# EAGLE design TesteTouchScreen (EAGLE 6.2)
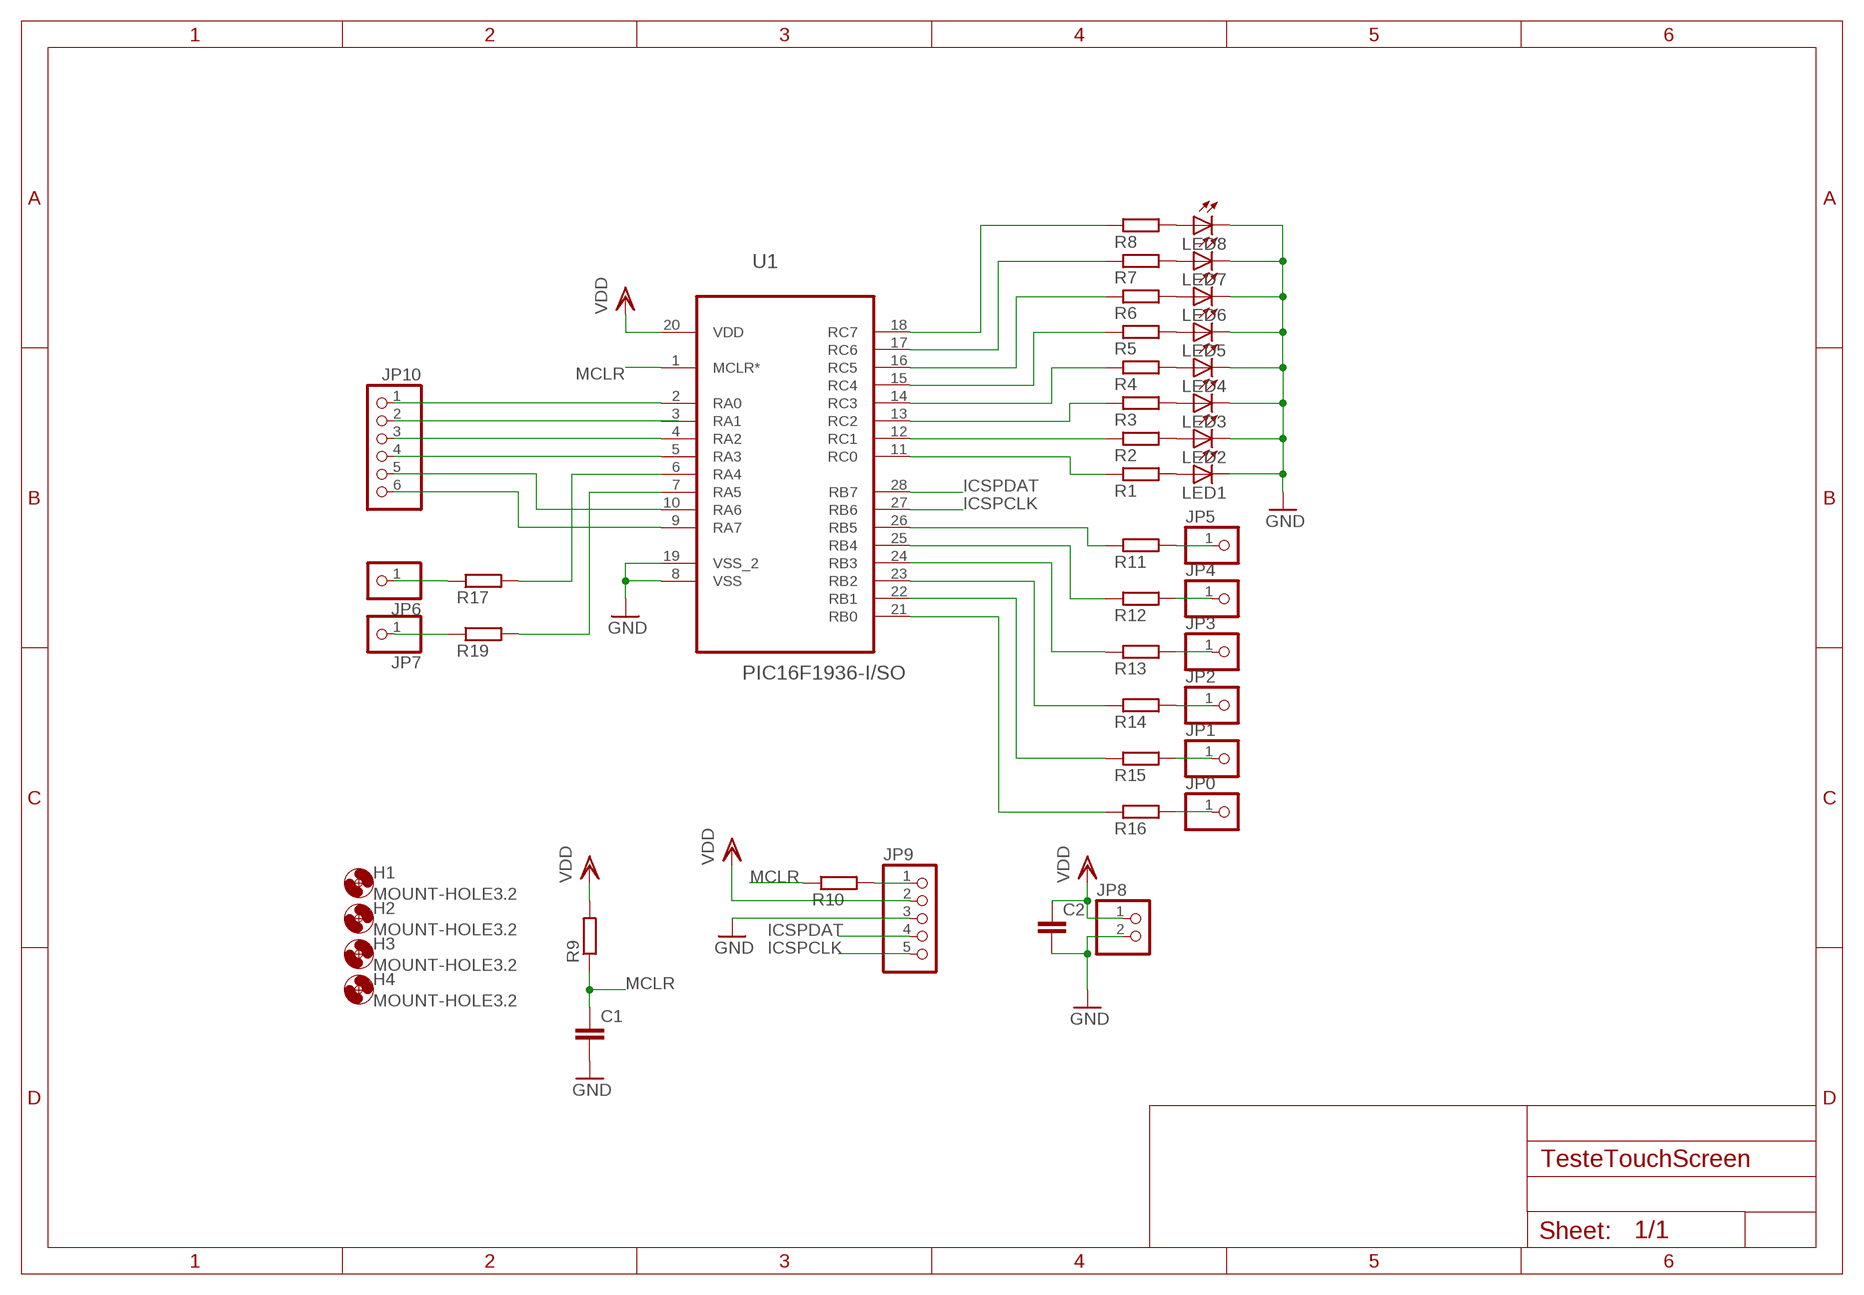
[diagram p0: schematic, sheet 1]

## Parts
C1  C-EUC1206  [C1206]
C2  C-EUC1206  [C1206]
H1  MOUNT-HOLE3.2  [3,2]
H2  MOUNT-HOLE3.2  [3,2]
H3  MOUNT-HOLE3.2  [3,2]
H4  MOUNT-HOLE3.2  [3,2]
JP0  PINHD-1X1  [1X01]
JP1  PINHD-1X1  [1X01]
JP2  PINHD-1X1  [1X01]
JP3  PINHD-1X1  [1X01]
JP4  PINHD-1X1  [1X01]
JP5  PINHD-1X1  [1X01]
JP6  PINHD-1X1  [1X01]
JP7  PINHD-1X1  [1X01]
JP8  PINHD-1X2  [1X02]
JP9  PINHD-1X5  [1X05]
JP10  PINHD-1X6  [1X06]
LED1  LED5MM  [LED5MM]
LED2  LED5MM  [LED5MM]
LED3  LED5MM  [LED5MM]
LED4  LED5MM  [LED5MM]
LED5  LED5MM  [LED5MM]
LED6  LED5MM  [LED5MM]
LED7  LED5MM  [LED5MM]
LED8  LED5MM  [LED5MM]
R1  R-EU_R0805  [R0805]
R2  R-EU_R0805  [R0805]
R3  R-EU_R0805  [R0805]
R4  R-EU_R0805  [R0805]
R5  R-EU_R0805  [R0805]
R6  R-EU_R0805  [R0805]
R7  R-EU_R0805  [R0805]
R8  R-EU_R0805  [R0805]
R9  R-EU_R0805  [R0805]
R10  R-EU_R0805  [R0805]
R11  R-EU_R0805  [R0805]
R12  R-EU_R0805  [R0805]
R13  R-EU_R0805  [R0805]
R14  R-EU_R0805  [R0805]
R15  R-EU_R0805  [R0805]
R16  R-EU_R0805  [R0805]
R17  R-EU_R0805  [R0805]
R19  R-EU_R0805  [R0805]
U1  PIC16F1936-I/SO  [SOIC127P1030X265-28N]

## Nets
GND: C1.2 C2.2 JP8.2 JP9.3 LED1.K(C) LED2.K(C) LED3.K(C) LED4.K(C) LED5.K(C) LED6.K(C) LED7.K(C) LED8.K(C) U1.8(VSS) U1.19(VSS_2)
ICSPCLK: JP9.5 U1.27(RB6)
ICSPDAT: JP9.4 U1.28(RB7)
MCLR: C1.1 R9.1 R10.1 U1.1(MCLR*)
N$1: JP6.1 R17.1
N$2: JP7.1 R19.1
N$3: JP0.1 R16.2
N$4: JP1.1 R15.2
N$5: JP2.1 R14.2
N$6: JP3.1 R13.2
N$7: JP5.1 R11.2
N$8: R17.2 U1.6(RA4)
N$9: LED1.A R1.2
N$10: LED2.A R2.2
N$11: JP4.1 R12.2
N$12: LED3.A R3.2
N$13: LED4.A R4.2
N$14: LED5.A R5.2
N$15: LED6.A R6.2
N$16: LED7.A R7.2
N$17: LED8.A R8.2
N$18: R1.1 U1.11(RC0)
N$19: R2.1 U1.12(RC1)
N$20: R3.1 U1.13(RC2)
N$21: R4.1 U1.14(RC3)
N$22: R5.1 U1.15(RC4)
N$23: R6.1 U1.16(RC5)
N$24: R7.1 U1.17(RC6)
N$25: R8.1 U1.18(RC7)
N$26: JP9.1 R10.2
N$27: R19.2 U1.7(RA5)
N$28: R11.1 U1.26(RB5)
N$29: R12.1 U1.25(RB4)
N$30: R13.1 U1.24(RB3)
N$31: R14.1 U1.23(RB2)
N$32: R15.1 U1.22(RB1)
N$33: R16.1 U1.21(RB0)
N$34: JP10.1 U1.2(RA0)
N$35: JP10.2
N$36: JP10.3 U1.4(RA2)
N$37: JP10.4 U1.5(RA3)
N$38: JP10.5 U1.10(RA6)
N$39: JP10.6 U1.9(RA7)
VDD: C2.1 JP8.1 JP9.2 R9.2 U1.20(VDD)
Unconnected: U1.3(RA1)

## Library data of the parts
C1 C2 = rcl:C-EU: CAPACITOR, European symbol
H1-H4 = holes:MOUNT-HOLE: MOUNTING HOLE with drill center marker
JP0 JP1-JP7 = pinhead:PINHD-1X1: PIN HEADER
JP8 = pinhead:PINHD-1X2: PIN HEADER
JP9 = pinhead:PINHD-1X5: PIN HEADER
JP10 = pinhead:PINHD-1X6: PIN HEADER
LED1-LED8 = led:LED: LED OSRAM: - CHIPLED LG R971, LG N971, LY N971, LG Q971, LY Q971, LO R971, LY R971 LH N974, LH R974 LS Q976, LO Q976, LY Q976 LO Q996 - Hyper CHIPLED LW Q18S LB Q993, LB Q99A, LB R99A - SideLED LS A670, LO A670, LY A670, LG A670, LP A670 LB A673, LV A673, LT A673, LW A673 LH A674 LY A675 LS A676, LA A676, LO A676, LY A676, LW A676 LS A679, LY A679, LG A679 - Hyper Micro SIDELED® LS Y876, LA Y876, LO Y876, LY Y876 LT Y87S - SmartLED LW L88C, LW L88S LB L89C, LB L89S, LG L890 LS L89K, LO L89K, LY L89K LS L896, LA L896, LO L896, LY L896 - TOPLED LS T670, LO T670, LY T670, LG T670, LP T670 LSG T670, LSP T670, LSY T670, LOP T670, LYG T670 LG T671, LOG T671, LSG T671 LB T673, LV T673, LT T673, LW T673 LH T674 LS T676, LA T676, LO T676, LY T676, LB T676, LH T676, LSB T676, LW T676 LB T67C, LV T67C, LT T67C, LS T67K, LO T67K, LY T67K, LW E67C LS E67B, LA E67B, LO E67B, LY E67B, LB E67C, LV E67C, LT E67C LW T67C LS T679, LY T679, LG T679 LS T770, LO T770, LY T770, LG T770, LP T770 LB T773, LV T773, LT T773, LW T773 LH T774 LS E675, LA E675, LY E675, LS T675 LS T776, LA T776, LO T776, LY T776, LB T776 LHGB T686 LT T68C, LB T68C - Hyper Mini TOPLED® LB M676 - Mini TOPLED Santana® LG M470 LS M47K, LO M47K, LY M47K Source: http://www.osram.convergy.de LUXEON: - LUMILED® LXK2-PW12-R00, LXK2-PW12-S00, LXK2-PW14-U00, LXK2-PW14-V00 LXK2-PM12-R00, LXK2-PM12-S00, LXK2-PM14-U00 LXK2-PE12-Q00, LXK2-PE12-R00, LXK2-PE12-S00, LXK2-PE14-T00, LXK2-PE14-U00 LXK2-PB12-K00, LXK2-PB12-L00, LXK2-PB12-M00, LXK2-PB14-N00, LXK2-PB14-P00, LXK2-PB14-Q00 LXK2-PR12-L00, LXK2-PR12-M00, LXK2-PR14-Q00, LXK2-PR14-R00 LXK2-PD12-Q00, LXK2-PD12-R00, LXK2-PD12-S00 LXK2-PH12-R00, LXK2-PH12-S00 LXK2-PL12-P00, LXK2-PL12-Q00, LXK2-PL12-R00 Source: www.luxeon.com KINGBRIGHT: KA-3528ASYC Source: www.kingbright.com
R1-R17 R19 = rcl:R-EU_: RESISTOR, European symbol
U1 = Microchip-PIC16F1936-I_SO:PIC16F1936-I/SO: IC PIC MCU FLASH 512KX14 ,SOIC-28; MPN: PIC16F1936-I/SO; OC_FARNELL: 1755820; OC_NEWARK: 45P4764; PACKAGE: SOIC-28; SUPPLIER: Microchip

## Board
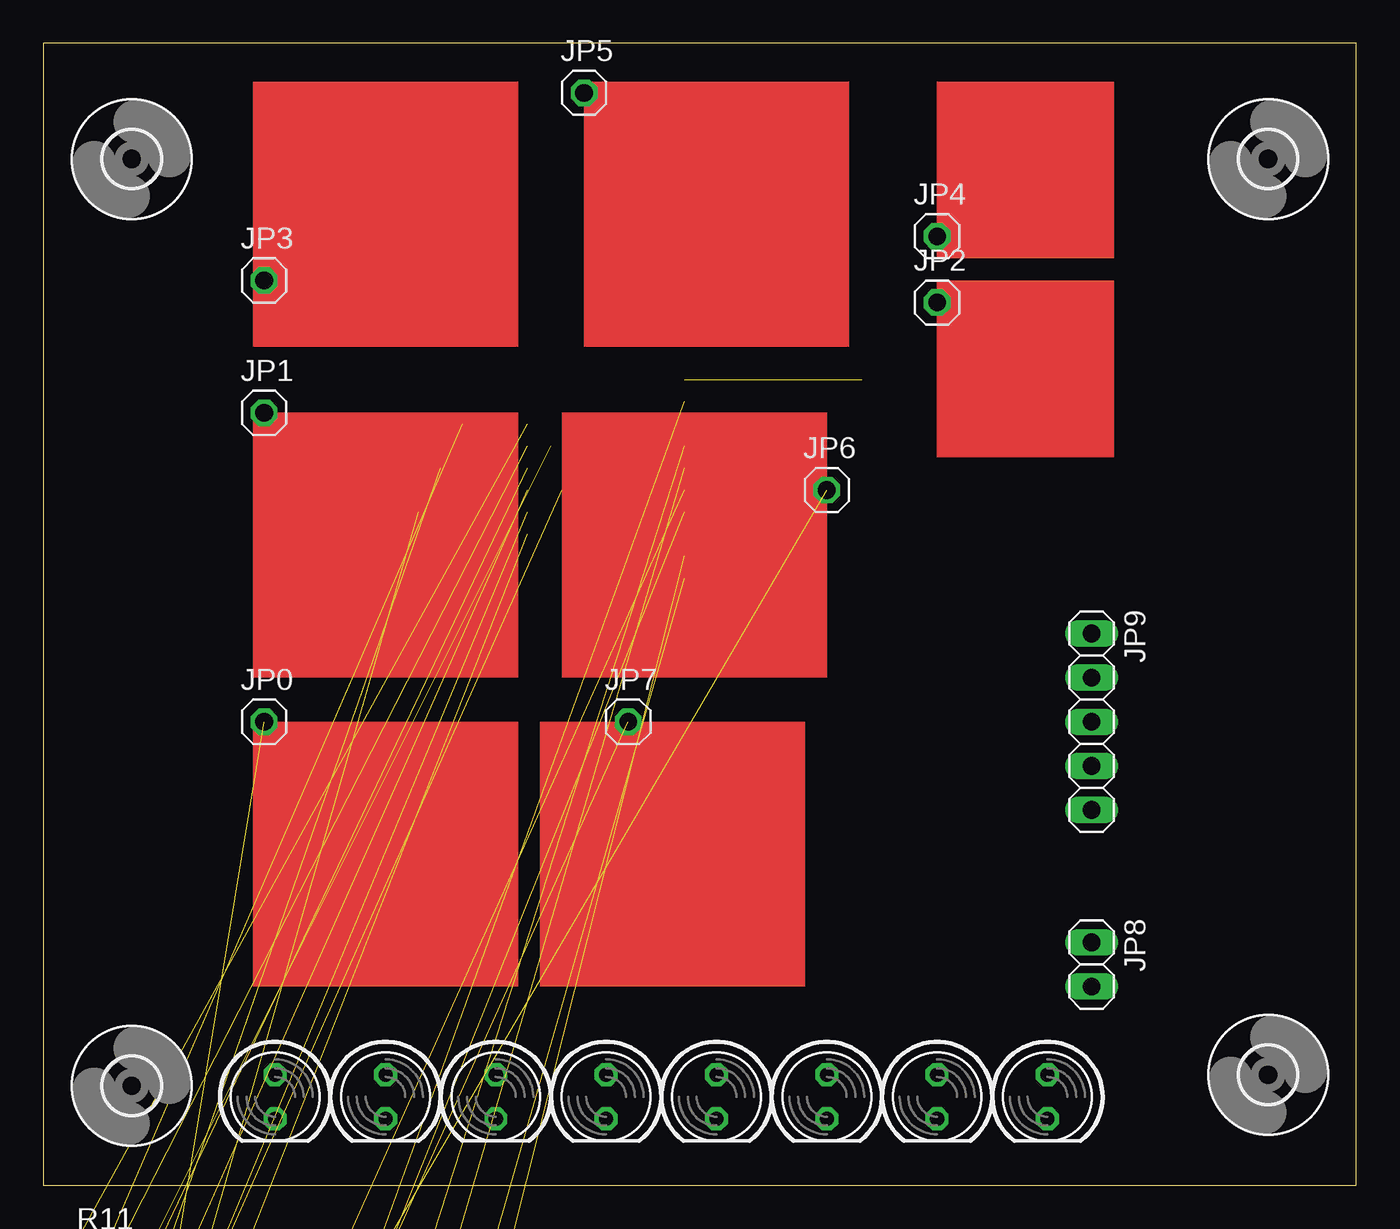
[diagram p1: board, top side]
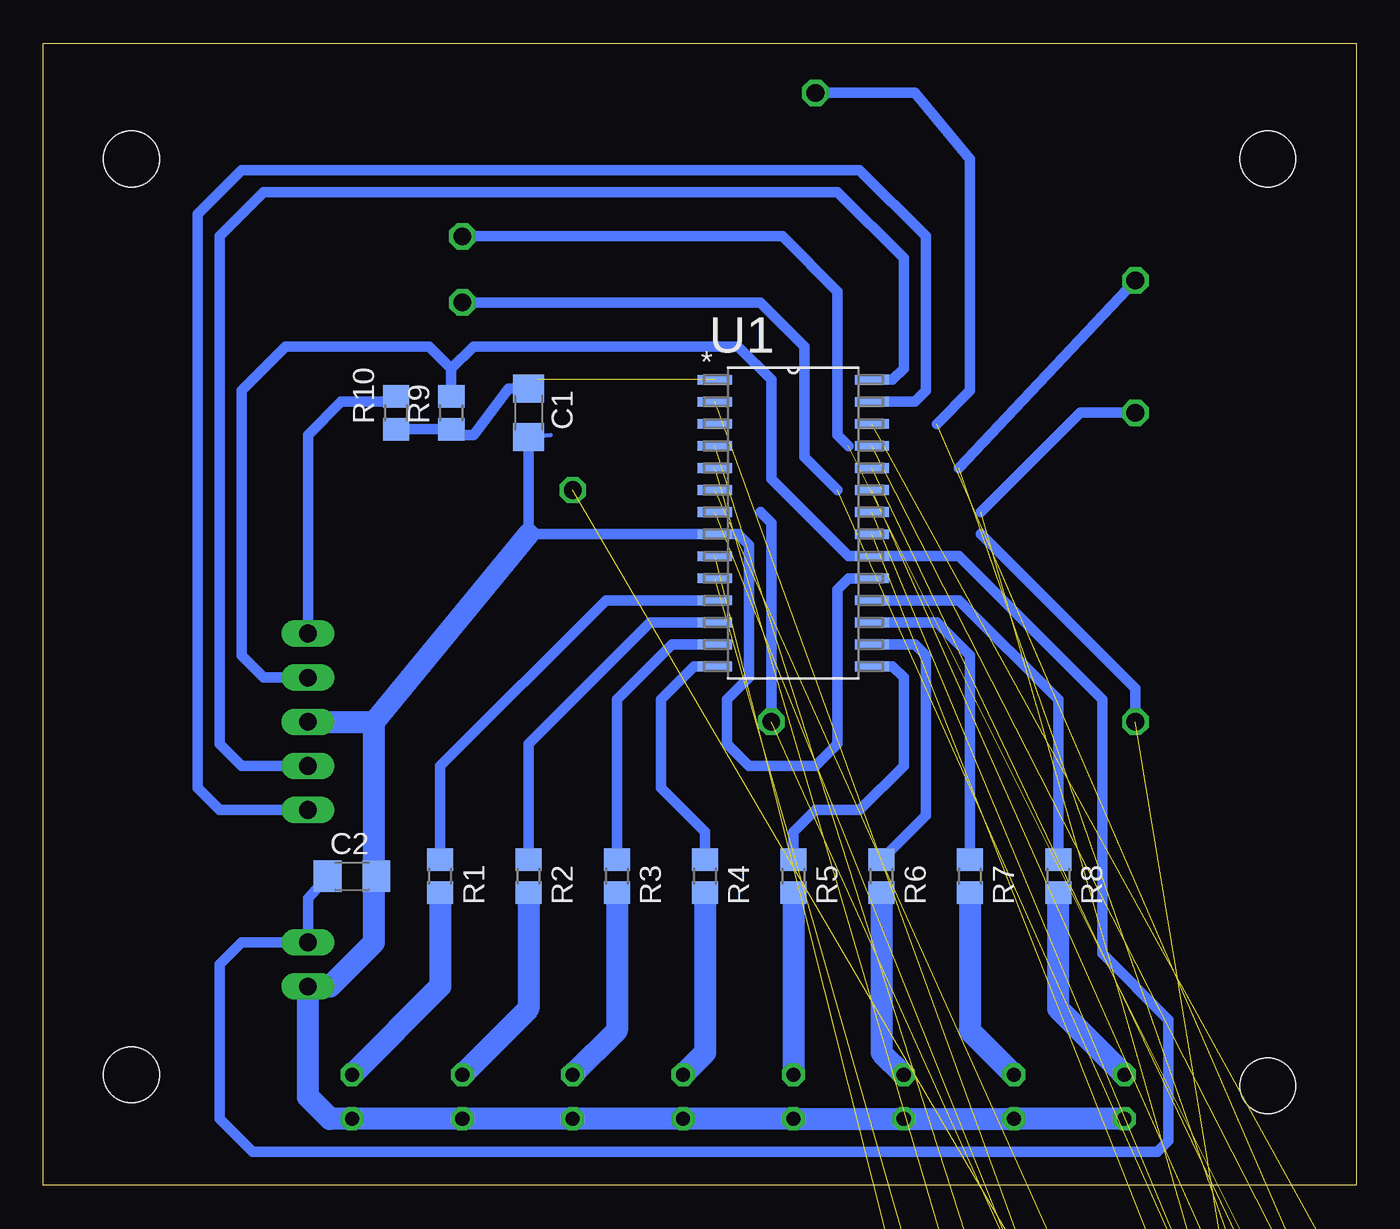
[diagram p2: board, bottom side, seen from below]

Size 75.55 x 65.71 mm. Coordinates in mm from the lower left corner, seen from the top.
Outline: 0,0 75.55,0 75.55,65.71 0,65.71 0,0
Copper layers (1*16): Top 0.035mm / dielectric 1.5mm / Bottom 0.035mm
Design rules: minimum track width 10mil, minimum drill 24mil, track to track 8mil, track to pad 8mil, pad to pad 8mil, via to via 8mil, smd to smd 8mil, copper to edge 40mil, drill to drill 8mil, minimum pad ring 10mil, minimum via ring 8mil, stop-mask expansion 4mil, vias tented up to drill 0mil, thermal gap 10mil

### Footprints (pad centres in the part's own frame; a part is rotated, then mirrored left to right if it is on the bottom)
C1206 = smd 1.6 x 1.8: 1 -1.4,0; 2 1.4,0
3,2 = hole 3.2: 0,0
1X01 = drill 1.016 octagon: 1 0,0
1X02 = drill 1.016 long: 1 -1.27,0; 2 1.27,0
1X05 = drill 1.016 long: 1 -5.08,0; 2 -2.54,0; 3 0,0; 4 2.54,0; 5 5.08,0
1X06 = drill 1.016 long: 1 -6.35,0; 2 -3.81,0; 3 -1.27,0; 4 1.27,0; 5 3.81,0; 6 6.35,0
LED5MM = drill 0.813 octagon: A -1.27,0; K 1.27,0
R0805 = smd 1.3 x 1.5: 1 -0.95,0; 2 0.95,0
SOIC127P1030X265-28N = smd 1.981 x 0.559: 1 -4.521,8.255; 2 -4.521,6.985; 3 -4.521,5.715; 4 -4.521,4.445; 5 -4.521,3.175; 6 -4.521,1.905; 7 -4.521,0.635; 8 -4.521,-0.635; 9 -4.521,-1.905; 10 -4.521,-3.175; 11 -4.521,-4.445; 12 -4.521,-5.715; 13 -4.521,-6.985; 14 -4.521,-8.255; 15 4.521,-8.255; 16 4.521,-6.985; 17 4.521,-5.715; 18 4.521,-4.445; 19 4.521,-3.175; 20 4.521,-1.905; 21 4.521,-0.635; 22 4.521,0.635; 23 4.521,1.905; 24 4.521,3.175; 25 4.521,4.445; 26 4.521,5.715; 27 4.521,6.985; 28 4.521,8.255

### Placement (x,y rotation side)
C1  47.62,44.45 270 bottom
C2  57.78,17.78 0 bottom
H1  70.48,6.35 0 top
H2  70.48,59.05 0 top
H3  5.08,5.71 0 top
H4  5.08,59.05 0 top
JP0  12.7,26.67 0 top
JP1  12.7,44.45 0 top
JP2  51.44,50.8 0 top
JP3  12.7,52.07 0 top
JP4  51.44,54.61 0 top
JP5  31.11,62.87 0 top
JP6  45.09,40.01 0 top
JP7  33.66,26.67 0 top
JP8  60.33,12.7 270 top
JP9  60.33,26.67 270 top
JP10  8.89,-49.53 0 top  (outside the outline)
LED1  57.78,5.08 270 top
LED2  51.44,5.08 270 top
LED3  45.09,5.08 270 top
LED4  38.73,5.08 270 top
LED5  32.38,5.08 270 top
LED6  26.04,5.08 270 top
LED7  19.68,5.08 270 top
LED8  13.34,5.08 270 top
R1  52.7,17.78 270 bottom
R2  47.62,17.78 270 bottom
R3  42.55,17.78 270 bottom
R4  37.47,17.78 270 bottom
R5  32.38,17.78 270 bottom
R6  27.3,17.78 270 bottom
R7  22.23,17.78 270 bottom
R8  17.14,17.78 270 bottom
R9  52.07,44.45 90 bottom
R10  55.24,44.45 90 bottom
R11  2.54,-3.81 0 top  (outside the outline)
R12  2.54,-8.89 0 top  (outside the outline)
R13  2.54,-13.97 0 top  (outside the outline)
R14  2.54,-19.05 0 top  (outside the outline)
R15  2.54,-24.13 0 top  (outside the outline)
R16  2.54,-29.21 0 top  (outside the outline)
R17  2.54,-34.29 0 top  (outside the outline)
R19  2.54,-44.45 0 top  (outside the outline)
U1  32.38,38.1 0 bottom

### Tracks (layer width: path | path; a pad name or v marks a point on that pad's centre or on a via)
GND
  Bottom 0.254: 46.35,43.18 C1.2
  Bottom 0.406: 56.52,17.78 56.52,16.51
  Bottom 0.61: U1.19 29.21,34.92 29.84,34.29 29.84,25.4 31.11,24.13 34.92,24.13 36.2,25.4 36.2,27.94 34.92,29.21 34.92,36.83 35.56,37.47 U1.8 47.62,37.47 C1.2 | C2.2 56.52,16.51
  Bottom 1.27: LED8.K LED7.K LED6.K LED5.K LED4.K LED3.K LED2.K LED1.K 59.05,3.81 60.33,5.08 JP8.2 59.05,11.43 56.52,13.97 56.52,16.51 56.52,26.67 | JP9.3 56.52,26.67 | 47.62,37.47 56.52,26.67
ICSPCLK
  Bottom 0.61: U1.27 25.4,45.09 24.77,45.72 24.77,54.61 28.57,58.42 64.14,58.42 66.67,55.88 66.67,22.86 65.41,21.59 JP9.5
ICSPDAT
  Bottom 0.61: U1.28 26.67,46.35 26.04,46.99 26.04,53.34 29.84,57.15 62.87,57.15 65.41,54.61 65.41,25.4 64.14,24.13 JP9.4
MCLR  (1 unrouted)
  Bottom 0.406: 47.12,46.35 C1.1
  Bottom 0.61: C1.1 48.77,45.85 50.8,43.18 51.75,43.18 R9.1 R10.1
N$1  (1 unrouted)
N$2  (1 unrouted)
  Bottom 0.61: 34.29,38.73 33.66,38.1 JP7.1
N$3  (1 unrouted)
  Bottom 0.61: JP0.1 12.7,28.57 21.59,37.47
N$4  (1 unrouted)
  Bottom 0.61: JP1.1 15.88,44.45 21.59,38.73
N$5  (1 unrouted)
  Bottom 0.61: JP2.1 34.29,50.8 31.75,48.26 31.75,41.91 29.84,40.01
N$6  (1 unrouted)
  Bottom 0.61: 22.86,41.27 JP3.1
N$7  (1 unrouted)
  Bottom 0.61: 24.13,43.81 22.23,45.72 22.23,59.05 25.4,62.87 JP5.1
N$8  (1 unrouted)
N$9
  Bottom 1.27: R1.2 52.7,11.43 LED1.A
N$10
  Bottom 1.27: R2.2 47.62,10.16 LED2.A
N$11  (1 unrouted)
  Bottom 0.61: 29.21,42.55 29.84,43.18 29.84,51.44 33.02,54.61 JP4.1
N$12
  Bottom 1.27: R3.2 42.55,8.89 LED3.A
N$13
  Bottom 1.27: R4.2 37.47,7.62 LED4.A
N$14
  Bottom 1.27: R5.2 LED5.A
N$15
  Bottom 1.27: R6.2 27.3,7.62 LED6.A
N$16
  Bottom 1.27: R7.2 22.23,8.89 LED7.A
N$17
  Bottom 1.27: LED8.A 17.14,10.16 R8.2
N$18
  Bottom 0.61: U1.11 43.18,33.66 52.7,24.13 R1.1
N$19
  Bottom 0.61: U1.12 40.64,32.38 47.62,25.4 R2.1
N$20
  Bottom 0.61: U1.13 39.37,31.11 42.55,27.94 R3.1
N$21
  Bottom 0.61: U1.14 38.1,29.84 40.01,27.94 40.01,22.86 37.47,20.32 R4.1
N$22
  Bottom 0.61: U1.15 26.67,29.84 26.04,29.21 26.04,24.13 28.57,21.59 31.11,21.59 32.38,20.32 R5.1
N$23
  Bottom 0.61: R6.1 24.77,21.27 24.77,30.48 25.4,31.11 U1.16
N$24
  Bottom 0.61: U1.17 24.13,32.38 22.23,30.48 R7.1
N$25
  Bottom 0.61: U1.18 22.86,33.66 17.14,27.94 R8.1
N$26
  Bottom 0.61: JP9.1 60.33,43.18 58.42,45.09 55.56,45.09 R10.2
N$27  (1 unrouted)
N$28  (1 unrouted)
N$29  (1 unrouted)
N$30  (1 unrouted)
N$31  (1 unrouted)
N$32  (1 unrouted)
N$33  (1 unrouted)
N$34  (1 unrouted)
N$36  (1 unrouted)
N$37  (1 unrouted)
N$38  (1 unrouted)
N$39  (1 unrouted)
VDD
  Bottom 0.61: JP9.2 62.87,29.21 64.14,30.48 64.14,45.72 61.59,48.26 53.34,48.26 52.07,46.99 | R9.2 52.07,46.99 | 52.07,46.99 50.8,48.26 35.56,48.26 33.66,46.35 33.66,40.64 29.21,36.2 U1.20 22.86,36.2 14.61,27.94 14.61,13.34 10.79,9.53 10.79,2.54 11.43,1.91 63.5,1.91 65.41,3.81 65.41,12.7 64.14,13.97 JP8.1 60.33,16.51 C2.1
(copper drawn outside any net)
  shapes: Top area x8